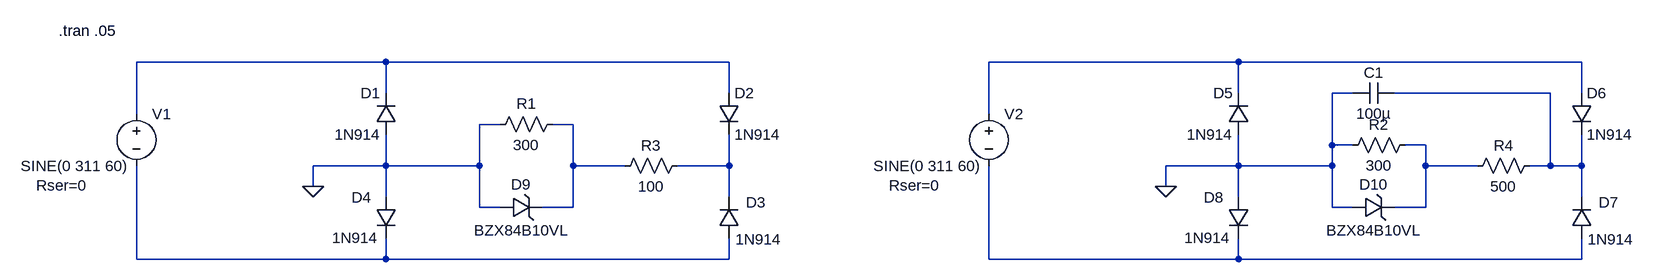
[diagram p0: schematic Diodo - RetificadorOndaCompleta_PonteCompleta_RegulacaoZener.asc]
Diodo - RetificadorOndaCompleta_PonteCompleta_RegulacaoZener.asc, the LTspice schematic file:
Version 4
SHEET 1 2136 680
WIRE 208 -32 -176 -32
WIRE 736 -32 208 -32
WIRE 1520 -32 1136 -32
WIRE 2048 -32 1520 -32
WIRE 208 16 208 -32
WIRE 736 16 736 -32
WIRE 1520 16 1520 -32
WIRE 1696 16 1664 16
WIRE 2000 16 1760 16
WIRE 2048 16 2048 -32
WIRE -176 48 -176 -32
WIRE 1136 48 1136 -32
WIRE 384 64 352 64
WIRE 496 64 464 64
WIRE 1664 96 1664 16
WIRE 1696 96 1664 96
WIRE 1808 96 1776 96
WIRE 208 128 208 80
WIRE 208 128 96 128
WIRE 352 128 352 64
WIRE 352 128 208 128
WIRE 496 128 496 64
WIRE 576 128 496 128
WIRE 736 128 736 80
WIRE 736 128 656 128
WIRE 1520 128 1520 80
WIRE 1520 128 1408 128
WIRE 1664 128 1664 96
WIRE 1664 128 1520 128
WIRE 1808 128 1808 96
WIRE 1888 128 1808 128
WIRE 2000 128 2000 16
WIRE 2000 128 1968 128
WIRE 2048 128 2048 80
WIRE 2048 128 2000 128
WIRE 96 160 96 128
WIRE 1408 160 1408 128
WIRE 208 176 208 128
WIRE 736 176 736 128
WIRE 1520 176 1520 128
WIRE 2048 176 2048 128
WIRE 352 192 352 128
WIRE 384 192 352 192
WIRE 496 192 496 128
WIRE 496 192 448 192
WIRE 1664 192 1664 128
WIRE 1696 192 1664 192
WIRE 1808 192 1808 128
WIRE 1808 192 1760 192
WIRE -176 272 -176 128
WIRE 208 272 208 240
WIRE 208 272 -176 272
WIRE 736 272 736 240
WIRE 736 272 208 272
WIRE 1136 272 1136 128
WIRE 1520 272 1520 240
WIRE 1520 272 1136 272
WIRE 2048 272 2048 240
WIRE 2048 272 1520 272
FLAG 96 160 0
FLAG 1408 160 0
SYMBOL res 480 48 R90
WINDOW 0 0 56 VBottom 2
WINDOW 3 32 56 VTop 2
SYMATTR InstName R1
SYMATTR Value 300
SYMBOL diode 224 80 R180
WINDOW 0 24 64 Left 2
WINDOW 3 24 0 Left 2
SYMATTR InstName D1
SYMATTR Value 1N914
SYMBOL voltage -176 32 R0
WINDOW 3 -178 96 Left 2
WINDOW 123 0 0 Left 2
WINDOW 39 -154 126 Left 2
SYMATTR Value SINE(0 311 60)
SYMATTR SpiceLine Rser=0
SYMATTR InstName V1
SYMBOL diode 720 16 R0
SYMATTR InstName D2
SYMATTR Value 1N914
SYMBOL diode 752 240 R180
WINDOW 0 -41 56 Left 2
WINDOW 3 -65 -1 Left 2
SYMATTR InstName D3
SYMATTR Value 1N914
SYMBOL diode 192 176 R0
WINDOW 0 -37 1 Left 2
WINDOW 3 -67 63 Left 2
SYMATTR InstName D4
SYMATTR Value 1N914
SYMBOL res 672 112 R90
WINDOW 0 0 56 VBottom 2
WINDOW 3 32 56 VTop 2
SYMATTR InstName R3
SYMATTR Value 100
SYMBOL zener 384 208 R270
WINDOW 0 36 32 VTop 2
WINDOW 3 -4 32 VBottom 2
SYMATTR InstName D9
SYMATTR Value BZX84B10VL
SYMATTR Description Diode
SYMATTR Type diode
SYMBOL res 1792 80 R90
WINDOW 0 0 56 VBottom 2
WINDOW 3 32 56 VTop 2
SYMATTR InstName R2
SYMATTR Value 300
SYMBOL diode 1536 80 R180
WINDOW 0 24 64 Left 2
WINDOW 3 24 0 Left 2
SYMATTR InstName D5
SYMATTR Value 1N914
SYMBOL voltage 1136 32 R0
WINDOW 3 -178 96 Left 2
WINDOW 123 0 0 Left 2
WINDOW 39 -154 126 Left 2
SYMATTR Value SINE(0 311 60)
SYMATTR SpiceLine Rser=0
SYMATTR InstName V2
SYMBOL diode 2032 16 R0
SYMATTR InstName D6
SYMATTR Value 1N914
SYMBOL diode 2064 240 R180
WINDOW 0 -41 56 Left 2
WINDOW 3 -65 -1 Left 2
SYMATTR InstName D7
SYMATTR Value 1N914
SYMBOL diode 1504 176 R0
WINDOW 0 -37 1 Left 2
WINDOW 3 -67 63 Left 2
SYMATTR InstName D8
SYMATTR Value 1N914
SYMBOL res 1984 112 R90
WINDOW 0 0 56 VBottom 2
WINDOW 3 32 56 VTop 2
SYMATTR InstName R4
SYMATTR Value 500
SYMBOL zener 1696 208 R270
WINDOW 0 36 32 VTop 2
WINDOW 3 -4 32 VBottom 2
SYMATTR InstName D10
SYMATTR Value BZX84B10VL
SYMATTR Description Diode
SYMATTR Type diode
SYMBOL cap 1760 0 R90
WINDOW 0 0 32 VBottom 2
WINDOW 3 32 32 VTop 2
SYMATTR InstName C1
SYMATTR Value 100µ
TEXT -296 -80 Left 2 !.tran .05

The netlist it stands for:
* Diodo - RetificadorOndaCompleta_PonteCompleta_RegulacaoZener.asc
R1 N004 0 300
D1 0 N001 1N914
V1 N001 N007 SINE(0 311 60) Rser=0
D2 N001 N006 1N914
D3 N007 N006 1N914
D4 0 N007 1N914
R3 N006 N004 100
D9 0 N004 BZX84B10VL
R2 N005 0 300
D5 0 N002 1N914
V2 N002 N008 SINE(0 311 60) Rser=0
D6 N002 N003 1N914
D7 N008 N003 1N914
D8 0 N008 1N914
R4 N003 N005 500
D10 0 N005 BZX84B10VL
C1 N003 0 100µ
.model D D
.lib standard.dio
.tran .05
.backanno
.end